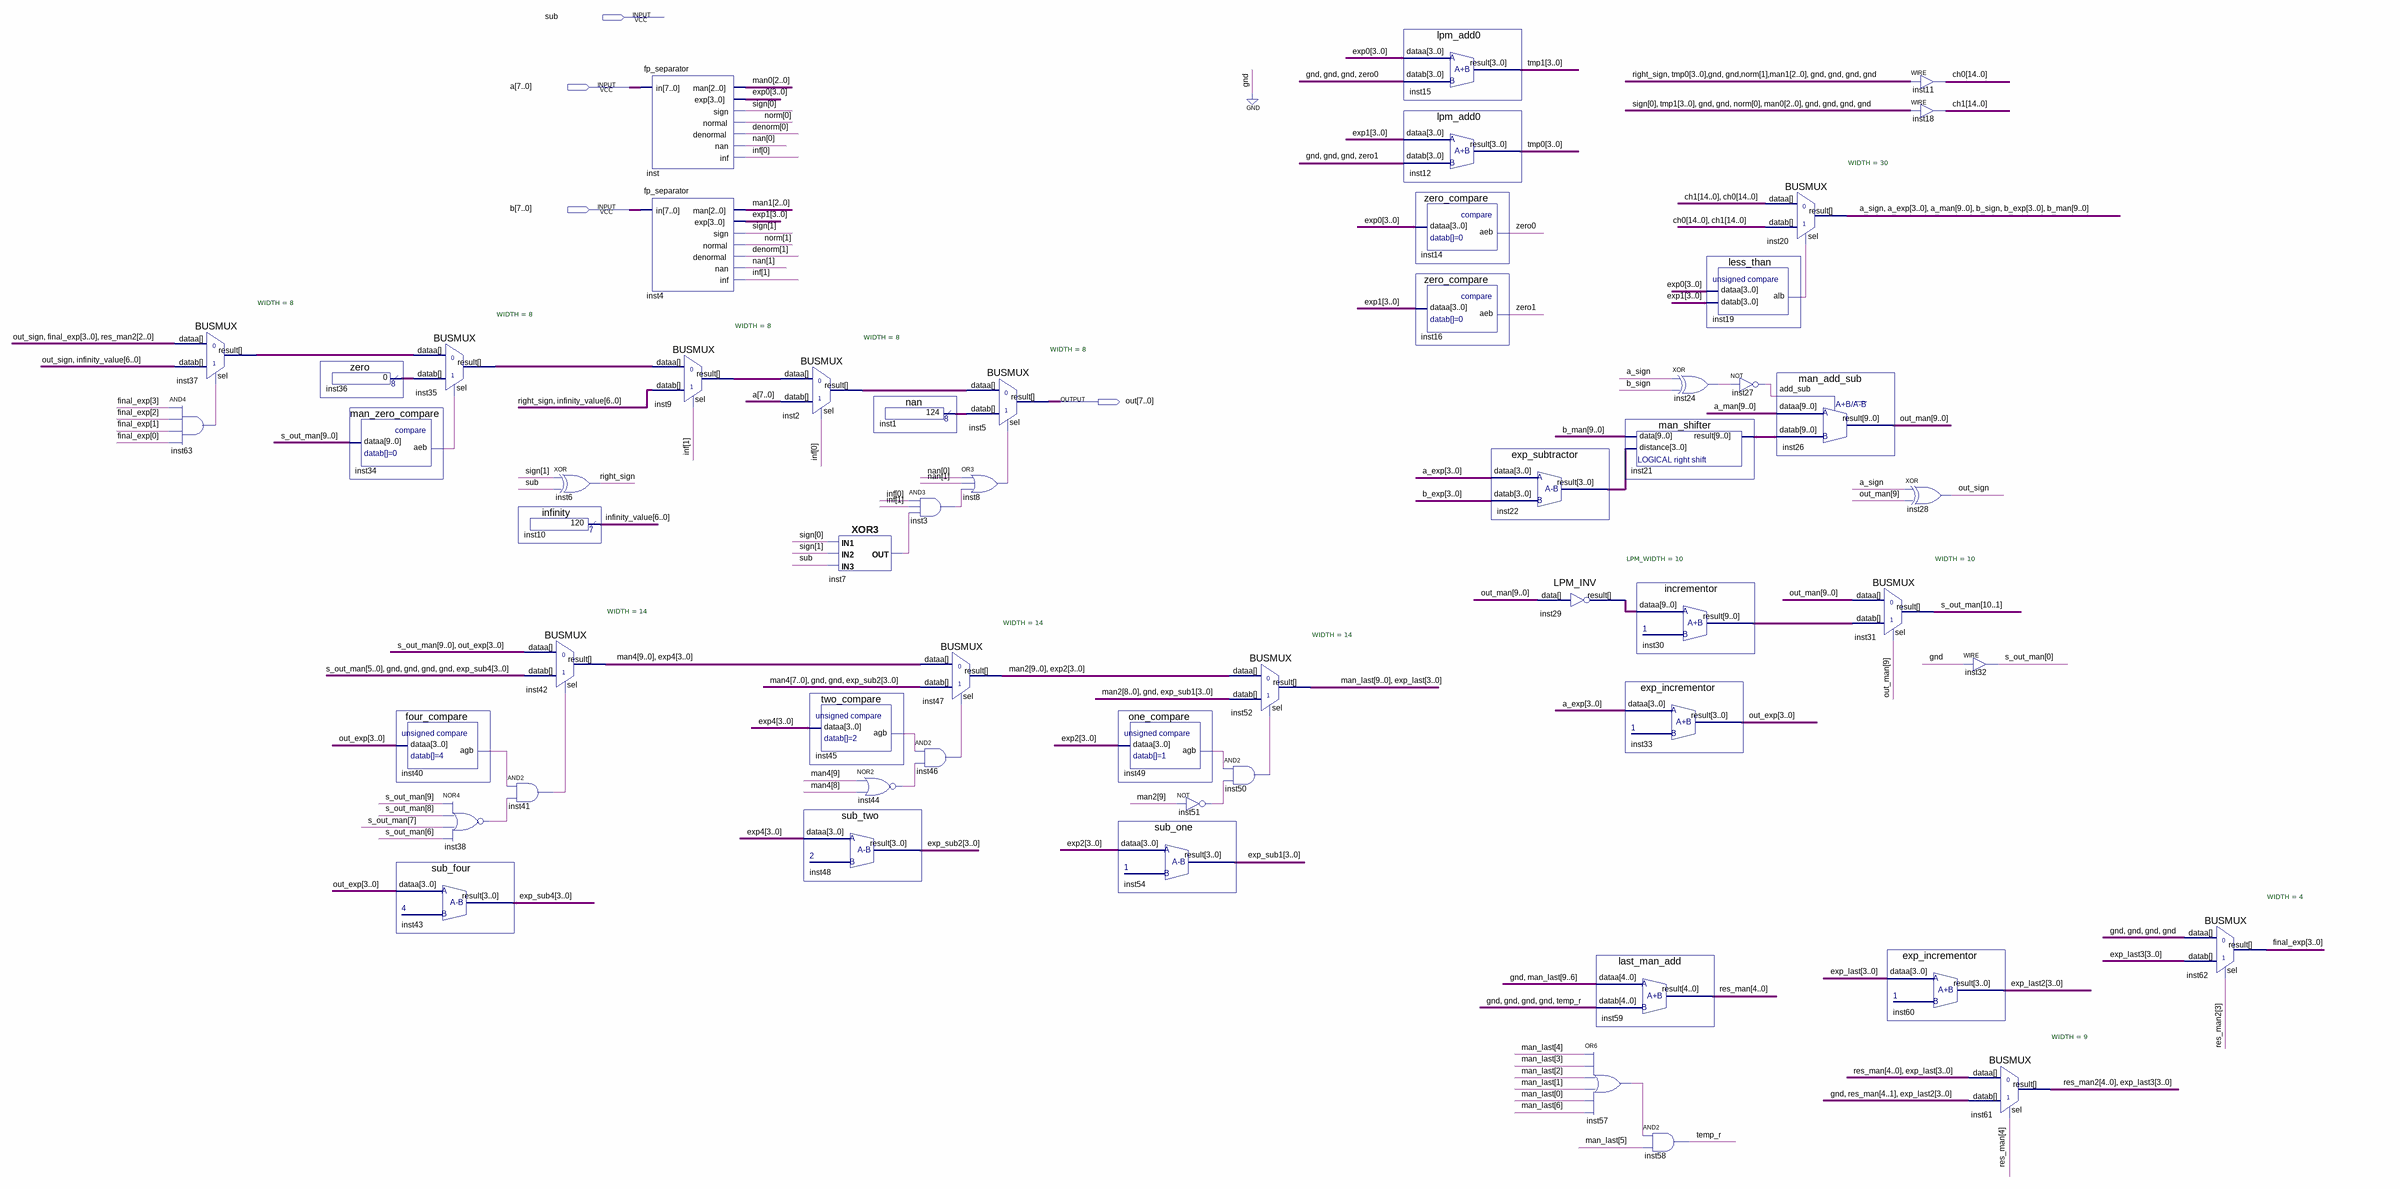
[diagram p0: schematic sheet]
// Quartus schematic fp_add_sub.bdf as structural Verilog: 56 symbols, 4 pins
module fp_add_sub (
  input  sub,
  input  [7:0] a,
  input  [7:0] b,
  output [7:0] out
);

  wire a_sign, b_sign, inst3_out, inst7_out, inst8_out, inst19_alb, inst24_out, inst27_out, inst34_aeb,
       inst38_out, inst40_agb, inst41_out, inst44_out, inst45_agb, inst46_out, inst49_agb, inst50_out,
       inst51_out, inst57_out, inst63_out, out_sign, right_sign, temp_r, zero0, zero1;
  wire [1:0] denorm, inf, nan, norm, sign;
  wire [2:0] man0, man1;
  wire [3:0] a_exp, b_exp, exp0, exp1, exp2, exp4, exp_last, exp_last2, exp_last3, exp_sub1, exp_sub2,
       exp_sub4, final_exp, inst22_result, out_exp, tmp0, tmp1;
  wire [4:0] res_man, res_man2;
  wire [6:0] infinity_value;
  wire [7:0] inst1_result, inst2_result, inst9_result, inst35_result, inst36_result, inst37_result;
  wire [9:0] a_man, b_man, inst21_result, inst29_result, inst30_result, man2, man4, man_last, out_man;
  wire [10:0] s_out_man;
  wire [14:0] ch0, ch1;

  BUSMUX #(.WIDTH(8)) inst37 (
    .datab({out_sign, infinity_value}), .sel(inst63_out), .dataa({out_sign, final_exp, res_man2[2:0]}),
    .result(inst37_result));
  and inst63 (inst63_out, final_exp[3], final_exp[2], final_exp[1], final_exp[0]);
  zero inst36 (.result(inst36_result));
  man_zero_compare inst34 (.dataa(s_out_man[9:0]), .aeb(inst34_aeb));
  BUSMUX #(.WIDTH(8)) inst35 (.datab(inst36_result), .sel(inst34_aeb), .dataa(inst37_result), .result(inst35_result));
  four_compare inst40 (.dataa(out_exp), .agb(inst40_agb));
  sub_four inst43 (.dataa(out_exp), .result(exp_sub4));
  nor inst38 (inst38_out, s_out_man[9], s_out_man[8], s_out_man[7], s_out_man[6]);
  and inst41 (inst41_out, inst40_agb, inst38_out);
  xor inst6 (right_sign, sign[1], sub);
  infinity inst10 (.result(infinity_value));
  BUSMUX #(.WIDTH(14)) inst42 (
    .datab({s_out_man[5:0], 4'b0000, exp_sub4}), .sel(inst41_out), .dataa({s_out_man[9:0], out_exp}),
    .result({man4, exp4}));
  fp_separator inst (
    .in(a), .man(man0), .exp(exp0), .sign(sign[0]), .normal(norm[0]), .denormal(denorm[0]), .nan(nan[0]),
    .inf(inf[0]));
  fp_separator inst4 (
    .in(b), .man(man1), .exp(exp1), .sign(sign[1]), .normal(norm[1]), .denormal(denorm[1]), .nan(nan[1]),
    .inf(inf[1]));
  BUSMUX #(.WIDTH(8)) inst9 (
    .datab({right_sign, infinity_value}), .sel(inf[1]), .dataa(inst35_result), .result(inst9_result));
  BUSMUX #(.WIDTH(8)) inst2 (.datab(a), .sel(inf[0]), .dataa(inst9_result), .result(inst2_result));
  XOR3 inst7 (.IN3(sub), .IN1(sign[0]), .IN2(sign[1]), .OUT(inst7_out));
  two_compare inst45 (.dataa(exp4), .agb(inst45_agb));
  sub_two inst48 (.dataa(exp4), .result(exp_sub2));
  nan inst1 (.result(inst1_result));
  nor inst44 (inst44_out, man4[9], man4[8]);
  and inst3 (inst3_out, inf[0], inf[1], inst7_out);
  BUSMUX #(.WIDTH(14)) inst47 (
    .datab({man4[7:0], 2'b00, exp_sub2}), .sel(inst46_out), .dataa({man4, exp4}), .result({man2, exp2}));
  and inst46 (inst46_out, inst45_agb, inst44_out);
  BUSMUX #(.WIDTH(8)) inst5 (.datab(inst1_result), .sel(inst8_out), .dataa(inst2_result), .result(out));
  or inst8 (inst8_out, nan[0], nan[1], inst3_out);
  one_compare inst49 (.dataa(exp2), .agb(inst49_agb));
  sub_one inst54 (.dataa(exp2), .result(exp_sub1));
  not inst51 (inst51_out, man2[9]);
  BUSMUX #(.WIDTH(14)) inst52 (
    .datab({man2[8:0], 1'b0, exp_sub1}), .sel(inst50_out), .dataa({man2, exp2}), .result({man_last, exp_last}));
  and inst50 (inst50_out, inst49_agb, inst51_out);
  lpm_add0 inst15 (.dataa(exp0), .datab({3'b000, zero0}), .result(tmp1));
  lpm_add0 inst12 (.dataa(exp1), .datab({3'b000, zero1}), .result(tmp0));
  zero_compare inst14 (.dataa(exp0), .aeb(zero0));
  zero_compare inst16 (.dataa(exp1), .aeb(zero1));
  exp_subtractor inst22 (.dataa(a_exp), .datab(b_exp), .result(inst22_result));
  LPM_INV #(.LPM_WIDTH(10)) inst29 (.data(out_man), .result(inst29_result));
  or inst57 (inst57_out, man_last[4], man_last[3], man_last[2], man_last[1], man_last[0], man_last[6]);
  man_shifter inst21 (.data(b_man), .distance(inst22_result), .result(inst21_result));
  exp_incrementor inst33 (.dataa(a_exp), .result(out_exp));
  last_man_add inst59 (.dataa({1'b0, man_last[9:6]}), .datab({4'b0000, temp_r}), .result(res_man));
  xor inst24 (inst24_out, a_sign, b_sign);
  incrementor inst30 (.dataa(inst29_result), .result(inst30_result));
  and inst58 (temp_r, inst57_out, man_last[5]);
  less_than inst19 (.dataa(exp0), .datab(exp1), .alb(inst19_alb));
  BUSMUX #(.WIDTH(30)) inst20 (
    .datab({ch0, ch1}), .sel(inst19_alb), .dataa({ch1, ch0}),
    .result({a_sign, a_exp, a_man, b_sign, b_exp, b_man}));
  not inst27 (inst27_out, inst24_out);
  man_add_sub inst26 (.add_sub(inst27_out), .dataa(a_man), .datab(inst21_result), .result(out_man));
  BUSMUX #(.WIDTH(10)) inst31 (.datab(inst30_result), .sel(out_man[9]), .dataa(out_man), .result(s_out_man[10:1]));
  assign ch0 = {right_sign, tmp0, 2'b00, norm[1], man1, 4'b0000};  // WIRE inst11
  assign ch1 = {sign[0], tmp1, 2'b00, norm[0], man0, 4'b0000};  // WIRE inst18
  xor inst28 (out_sign, a_sign, out_man[9]);
  exp_incrementor inst60 (.dataa(exp_last), .result(exp_last2));
  assign s_out_man[0] = 1'b0;  // WIRE inst32
  BUSMUX #(.WIDTH(9)) inst61 (
    .datab({1'b0, res_man[4:1], exp_last2}), .sel(res_man[4]), .dataa({res_man, exp_last}),
    .result({res_man2, exp_last3}));
  BUSMUX #(.WIDTH(4)) inst62 (.datab(exp_last3), .sel(res_man2[3]), .dataa(4'b0000), .result(final_exp));
endmodule
